# Altium schematic sheet SDCARD.SchDoc
size A4; SheetNumber: 14; SheetTotal: 15
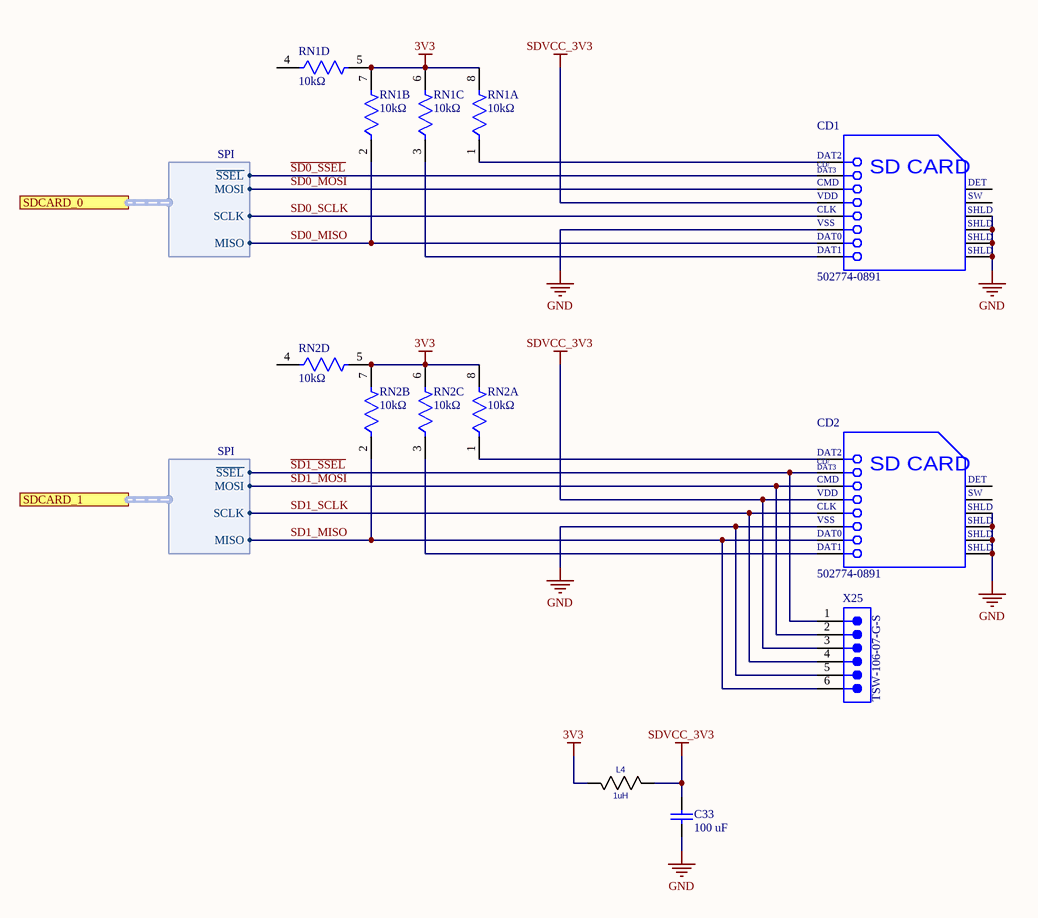
[diagram p0: SDCARD.SchDoc]

## Parts
C33  Capacitance: 100 uF  [CAPC3216X190X55ML30T25]  (hidden comment: GRM31CR60J107ME39L)
CD1  502774-0891  [MOLX-502774-0891_V]
CD2  502774-0891  [MOLX-502774-0891_V]
L4  value 1uH  [L-CHIP]  (hidden comment: L-CHIP)
RN1  Resistance: 10kΩ  [FP-CAT16-F4-MFG]  (hidden comment: CAT16-1002F4LF)  (parts A,B,C,D of 4)
RN2  Resistance: 10kΩ  [FP-CAT16-F4-MFG]  (hidden comment: CAT16-1002F4LF)  (parts A,B,C,D of 4)
X25  TSW-106-07-G-S  [SMTC-TSW-106-07-X-S]

## Ports
SDCARD_0 (harness SPI), SDCARD_1 (harness SPI)

## Harnesses
SPI: ~{SSEL}, SCLK, MOSI, MISO

## Nets
3V3: L4.2 RN1.5 RN1.6 RN1.7 RN1.8 RN2.5 RN2.6 RN2.7 RN2.8
GND: C33.1 CD1.6(VSS) CD1.11(SHLD) CD1.12(SHLD) CD1.13(SHLD) CD1.14(SHLD) CD2.6(VSS) CD2.11(SHLD) CD2.12(SHLD) CD2.13(SHLD) CD2.14(SHLD) X25.5
SDVCC_3V3: C33.2 CD1.4(VDD) CD2.4(VDD) L4.1 X25.3
~{SD0_SSEL}: CD1.2(CD/DAT3) ; port SDCARD_0.~{SSEL}
~{SD1_SSEL}: CD2.2(CD/DAT3) X25.1 ; port SDCARD_1.~{SSEL}
SD0_MISO: CD1.7(DAT0) RN1.2 ; port SDCARD_0.MISO
SD0_MOSI: CD1.3(CMD) ; port SDCARD_0.MOSI
SD0_SCLK: CD1.5(CLK) ; port SDCARD_0.SCLK
SD1_MISO: CD2.7(DAT0) RN2.2 X25.6 ; port SDCARD_1.MISO
SD1_MOSI: CD2.3(CMD) X25.2 ; port SDCARD_1.MOSI
SD1_SCLK: CD2.5(CLK) X25.4 ; port SDCARD_1.SCLK
NetCD1_1: CD1.1(DAT2) RN1.1
NetCD1_8: CD1.8(DAT1) RN1.3
NetCD2_1: CD2.1(DAT2) RN2.1
NetCD2_8: CD2.8(DAT1) RN2.3

Not connected (* = marked no-connect by the designer): CD1 9(DETECT) 10(SWITCH); CD2 9(DETECT) 10(SWITCH); RN1 4; RN2 4

## Notes on the sheet
- (in symbol CMP-2000-05248-1) CD/; DAT3; SD CARD; DET; SW

## Library data of the parts
C33 = CMP-1662-00011-2: Chip Capacitor, 100 uF, +/- 20%, 6.3 V, -55 to 85 degC, 1206 (3216 Metric), RoHS, Tape and Reel; Manufacturer: Murata; value: 100 uF; PackageDescription: 2-Pin Surface Mount Device, Body 3.2 x 1.6 mm; PartNumber: GRM31CR60J107ME39L; Manufacturer Part Number: GRM31CR60J107ME39L; Case/Package: 1206; Category: Cap
CD1 CD2 = CMP-2000-05248-1: Micro SD Memory Card Connector, 0.5 A, 10 V (DC), -25 to 85 degC, 8-Pin SMT, RoHS, Tape and Reel; Manufacturer: Molex; Manufacturer Part Number: 5027740891; value: 5027740891; Category: Connector; Case/Package: Micro SD (molex 5027740891 )
RN1 RN2 = CMP-07230-000003-1: RES ARRAY 4 RES 10K OHM 1206; Manufacturer: Bourns; Voltage Rating: 50V; Power Rating: 0.25W; Tolerance: 1%; Number Of Resistors: 4; Value: 10kΩ; Temperature Coefficient: 200ppm/°C; Description: Res Thick Film Array 10K Ohm 1% ISOL Molded 8-Pin 1206 Concave SMD Paper T/R; Power Per Resistor: 0.0625W; Manufacturer Part Number: CAT16-1002F4LF; Category: Res; Termination: Concave; Series: CAT16; Height: 0.6mm; Device Class L2: Resistors; Digikey Description: RES ARRAY 4 RES 10K OHM 1206; ComponentLink2Description: Datasheet; Temperature Range High: +125°C; ComponentLink2URL: https://www.bourns.com/docs/Product-Datasheets/CATCAY.pdf; Temperature: -55°C to +125°C; Temperature Range Low: -55°C; Octopart: https://octopart.com/cat16-1002f4lf-bourns-1624551; Mouser Description: Resistor Networks & Arrays 10K 1% Concave 4resistors; RoHS: TRUE; Device Class L1: Passive Components; Lead Free: Yes; Automotive: No; Package: CAT16-F4; Device Class L3: Resistor Arrays
X25 = CMP-1024-00383-1: 0.025" SQ Post Header, Through-hole, Vertical, -55 to 125 degC, 2.54 mm Pitch, 6-Pin, Male, RoHS; Manufacturer: Samtec; Pitch: 2.54 mm; value: 6 pin header 2.54mm; PackageDescription: .025[0.64] SQ. Post Terminal Strip Assembly; PartNumber: TSW-106-07-G-S; Manufacturer Part Number: TSW-106-07-G-S; Case/Package: PLS-6; Category: Connector
L4 = L-CHIP: Case/Package: 0805; Category: Inductor